# EAGLE design ear-o_mic_board (EAGLE 8.3.2)
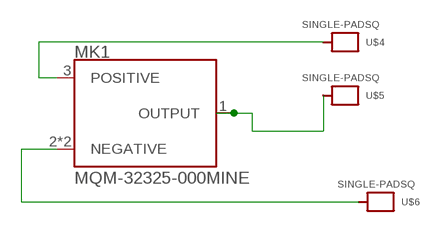
[diagram p0: schematic, sheet 1]

## Parts
MK1  MQM-32325-000MINE  [MIC_MINE]
U$4  SINGLE-PADSQ  [SQUAREPAD0.8]
U$5  SINGLE-PADSQ  [SQUAREPAD0.8]
U$6  SINGLE-PADSQ  [SQUAREPAD0.8]

## Nets
NEG: MK1.2(NEGATIVE) MK1.P$1(NEGATIVE) U$6.P$1
POS: MK1.3(POSITIVE) U$4.P$1
SIG: MK1.1(OUTPUT) U$5.P$1

## Library data of the parts
MK1 = MQM-32325-000:MQM-32325-000: Microphone
U$4-U$6 = my-parts-v1:SINGLE-PAD

## Board
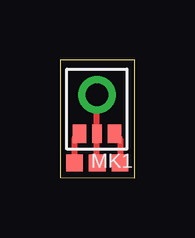
[diagram p1: board, top side]
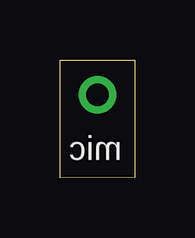
[diagram p2: board, bottom side, seen from below]

Size 3.11 x 4.92 mm. Coordinates in mm from the lower left corner, seen from the top.
Outline: 0,0 3.11,0 3.11,4.91 0,4.92 0,0
Copper layers 1: Top 0.07mm
Design rules "eC_1Layer_PClass4_BaseCopperO70 *": minimum track width 0.2mm, minimum drill 0.35mm, track to track 0.25mm, track to pad 0.25mm, pad to pad 0.25mm, via to via 0.25mm, smd to smd 0mil, copper to edge 0.25mm, drill to drill 0.35mm, minimum pad ring 0.3mm, minimum via ring 0.3mm, stop-mask expansion 0mil, vias tented up to drill 0.45mm, thermal gap 0.2mm

### Footprints (pad centres in the part's own frame; a part is rotated, then mirrored left to right if it is on the bottom)
MIC_MINE = smd 0.572 x 0.762: 1 -0.731,1.662; 3 0.731,1.662 | smd 0.381 x 0.762: 2 0,1.662 | drill 0.95: P$1 0,0.04
SQUAREPAD0.8 = smd 0.7 x 0.7: P$1 0,0

### Placement (x,y rotation side)
MK1  1.54,3.5 180 top
U$4  0.6,0.61 0 top
U$5  2.5,0.61 0 top
U$6  1.55,0.61 0 top

### Tracks (layer width: path | path; a pad name or v marks a point on that pad's centre or on a via)
NEG
  Top 0.25: MK1.P$1 MK1.2 U$6.P$1
POS
  Top 0.25: MK1.3 0.6,1.63 U$4.P$1
SIG
  Top 0.25: MK1.1 2.5,1.61 U$5.P$1

### Text on the board
bPlace: mic